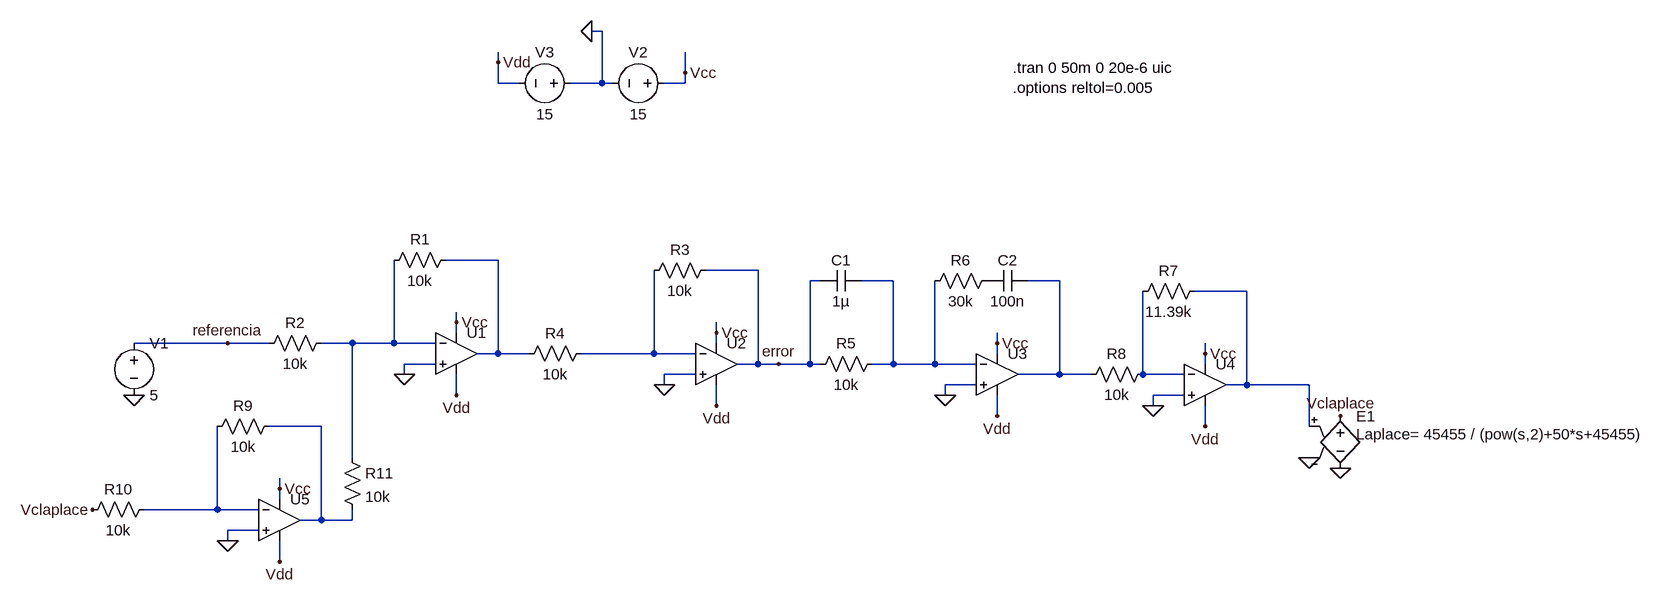
[diagram p0: schematic PID_circuito_laplace.asc]
PID_circuito_laplace.asc, the LTspice schematic file:
Version 4.1
SHEET 1 1580 680
WIRE -144 -400 -160 -400
WIRE -304 -352 -304 -368
WIRE -16 -336 -16 -368
WIRE -304 -320 -304 -352
WIRE -272 -320 -304 -320
WIRE -144 -320 -144 -400
WIRE -144 -320 -192 -320
WIRE -128 -320 -144 -320
WIRE -16 -320 -16 -336
WIRE -16 -320 -48 -320
WIRE -304 -48 -384 -48
WIRE 96 -32 16 -32
WIRE 192 -16 176 -16
WIRE 304 -16 256 -16
WIRE 560 -16 512 -16
WIRE 848 0 768 0
WIRE -368 48 -368 32
WIRE -368 64 -368 48
WIRE 32 64 32 48
WIRE -720 80 -864 80
WIRE -656 80 -720 80
WIRE -528 80 -576 80
WIRE -464 80 -464 -48
WIRE -464 80 -528 80
WIRE -400 80 -464 80
WIRE 32 80 32 64
WIRE 464 80 464 64
WIRE -304 96 -304 -48
WIRE -304 96 -336 96
WIRE -256 96 -304 96
WIRE -64 96 -64 -32
WIRE -64 96 -176 96
WIRE 0 96 -64 96
WIRE 464 96 464 80
WIRE 784 96 784 80
WIRE -400 112 -448 112
WIRE 96 112 96 -32
WIRE 96 112 64 112
WIRE 128 112 96 112
WIRE 176 112 176 -16
WIRE 176 112 128 112
WIRE 192 112 176 112
WIRE 304 112 304 -16
WIRE 304 112 272 112
WIRE 368 112 368 -16
WIRE 368 112 304 112
WIRE 432 112 368 112
WIRE 784 112 784 96
WIRE -448 128 -448 112
WIRE 0 128 -48 128
WIRE 560 128 560 -16
WIRE 560 128 496 128
WIRE 608 128 560 128
WIRE 688 128 688 0
WIRE 752 128 688 128
WIRE -48 144 -48 128
WIRE 432 144 384 144
WIRE 848 144 848 0
WIRE 848 144 816 144
WIRE 944 144 848 144
WIRE -368 160 -368 128
WIRE 384 160 384 144
WIRE 752 160 704 160
WIRE 32 176 32 144
WIRE 704 176 704 160
WIRE 464 192 464 160
WIRE -576 208 -656 208
WIRE 784 208 784 176
WIRE 944 208 944 144
WIRE -528 256 -528 80
WIRE -640 304 -640 288
WIRE -640 320 -640 304
WIRE -736 336 -736 208
WIRE -736 336 -848 336
WIRE -672 336 -736 336
WIRE -576 352 -576 208
WIRE -576 352 -608 352
WIRE -528 352 -528 336
WIRE -528 352 -576 352
WIRE -672 368 -720 368
WIRE -720 384 -720 368
WIRE -640 416 -640 384
FLAG -368 160 Vdd
FLAG -368 48 Vcc
FLAG -448 128 0
FLAG 32 176 Vdd
FLAG 32 64 Vcc
FLAG -48 144 0
FLAG 464 192 Vdd
FLAG 464 80 Vcc
FLAG 384 160 0
FLAG 784 208 Vdd
FLAG 784 96 Vcc
FLAG 704 176 0
FLAG -640 416 Vdd
FLAG -640 304 Vcc
FLAG -720 384 0
FLAG -928 336 Vclaplace
FLAG 128 112 error
FLAG -864 160 0
FLAG -720 80 referencia
FLAG 992 192 Vclaplace
FLAG 944 256 0
FLAG 992 272 0
FLAG -160 -400 0
FLAG -16 -336 Vcc
FLAG -304 -352 Vdd
SYMBOL res -368 -64 R90
WINDOW 0 0 56 VBottom 2
WINDOW 3 32 56 VTop 2
SYMATTR InstName R1
SYMATTR Value 10k
SYMBOL OpAmps\\UniversalOpAmp2 -368 96 R0
SYMATTR InstName U1
SYMBOL res -560 64 R90
WINDOW 0 0 56 VBottom 2
WINDOW 3 32 56 VTop 2
SYMATTR InstName R2
SYMATTR Value 10k
SYMBOL res 32 -48 R90
WINDOW 0 0 56 VBottom 2
WINDOW 3 32 56 VTop 2
SYMATTR InstName R3
SYMATTR Value 10k
SYMBOL OpAmps\\UniversalOpAmp2 32 112 R0
SYMATTR InstName U2
SYMBOL res -160 80 R90
WINDOW 0 0 56 VBottom 2
WINDOW 3 32 56 VTop 2
SYMATTR InstName R4
SYMATTR Value 10k
SYMBOL res 288 96 R90
WINDOW 0 0 56 VBottom 2
WINDOW 3 32 56 VTop 2
SYMATTR InstName R5
SYMATTR Value 10k
SYMBOL cap 256 -32 R90
WINDOW 0 0 32 VBottom 2
WINDOW 3 32 32 VTop 2
SYMATTR InstName C1
SYMATTR Value 1µ
SYMBOL res 464 -32 R90
WINDOW 0 0 56 VBottom 2
WINDOW 3 32 56 VTop 2
SYMATTR InstName R6
SYMATTR Value 30k
SYMBOL OpAmps\\UniversalOpAmp2 464 128 R0
SYMATTR InstName U3
SYMBOL cap 512 -32 R90
WINDOW 0 0 32 VBottom 2
WINDOW 3 32 32 VTop 2
SYMATTR InstName C2
SYMATTR Value 100n
SYMBOL res 784 -16 R90
WINDOW 0 0 56 VBottom 2
WINDOW 3 32 56 VTop 2
SYMATTR InstName R7
SYMATTR Value 11.39k
SYMBOL OpAmps\\UniversalOpAmp2 784 144 R0
SYMATTR InstName U4
SYMBOL res 704 112 R90
WINDOW 0 0 56 VBottom 2
WINDOW 3 32 56 VTop 2
SYMATTR InstName R8
SYMATTR Value 10k
SYMBOL res -640 192 R90
WINDOW 0 0 56 VBottom 2
WINDOW 3 32 56 VTop 2
SYMATTR InstName R9
SYMATTR Value 10k
SYMBOL OpAmps\\UniversalOpAmp2 -640 352 R0
SYMATTR InstName U5
SYMBOL res -832 320 R90
WINDOW 0 0 56 VBottom 2
WINDOW 3 32 56 VTop 2
SYMATTR InstName R10
SYMATTR Value 10k
SYMBOL res -544 240 R0
SYMATTR InstName R11
SYMATTR Value 10k
SYMBOL voltage -864 64 R0
WINDOW 123 0 0 Left 0
WINDOW 39 0 0 Left 0
SYMATTR InstName V1
SYMATTR Value 5
SYMBOL e 992 176 R0
WINDOW 3 24 44 Left 2
SYMATTR InstName E1
SYMATTR Value Laplace= 45455 / (pow(s,2)+50*s+45455)
SYMBOL voltage -32 -320 R90
WINDOW 0 -32 56 VBottom 2
WINDOW 3 32 56 VTop 2
SYMATTR InstName V2
SYMATTR Value 15
SYMBOL voltage -176 -320 R90
WINDOW 0 -32 56 VBottom 2
WINDOW 3 32 56 VTop 2
SYMATTR InstName V3
SYMATTR Value 15
TEXT 488 -344 Left 2 !.tran 0 50m 0 20e-6 uic\n.options reltol=0.005

The netlist it stands for:
* PID_circuito_laplace.asc
R1 N001 N005 10k
X§U1 0 N005 Vcc Vdd N001 level2 Avol=1Meg GBW=10Meg Slew=10Meg Ilimit=25m Rail=0 Vos=0 En=0 Enk=0 In=0 Ink=0 Rin=500Meg  ; pins In+ In- V+ V- OUT
R2 N005 referencia 10k
R3 error N006 10k
X§U2 0 N006 Vcc Vdd error level2 Avol=1Meg GBW=10Meg Slew=10Meg Ilimit=25m Rail=0 Vos=0 En=0 Enk=0 In=0 Ink=0 Rin=500Meg  ; pins In+ In- V+ V- OUT
R4 N006 N001 10k
R5 N002 error 10k
C1 N002 error 1µ
R6 P001 N002 30k
X§U3 0 N002 Vcc Vdd N003 level2 Avol=1Meg GBW=10Meg Slew=10Meg Ilimit=25m Rail=0 Vos=0 En=0 Enk=0 In=0 Ink=0 Rin=500Meg  ; pins In+ In- V+ V- OUT
C2 N003 P001 100n
R7 N004 N007 11.39k
X§U4 0 N007 Vcc Vdd N004 level2 Avol=1Meg GBW=10Meg Slew=10Meg Ilimit=25m Rail=0 Vos=0 En=0 Enk=0 In=0 Ink=0 Rin=500Meg  ; pins In+ In- V+ V- OUT
R8 N007 N003 10k
R9 N008 N009 10k
X§U5 0 N009 Vcc Vdd N008 level2 Avol=1Meg GBW=10Meg Slew=10Meg Ilimit=25m Rail=0 Vos=0 En=0 Enk=0 In=0 Ink=0 Rin=500Meg  ; pins In+ In- V+ V- OUT
R10 N009 Vclaplace 10k
R11 N005 N008 10k
V1 referencia 0 5
E1 Vclaplace 0 N004 0 Laplace= 45455 / (pow(s,2)+50*s+45455)
V2 Vcc 0 15
V3 0 Vdd 15
.tran 0 50m 0 20e-6 uic
.options reltol=0.005
.lib UniversalOpAmp2.lib
.backanno
.end